# EAGLE schematic aquaUI (EAGLE 6.4)
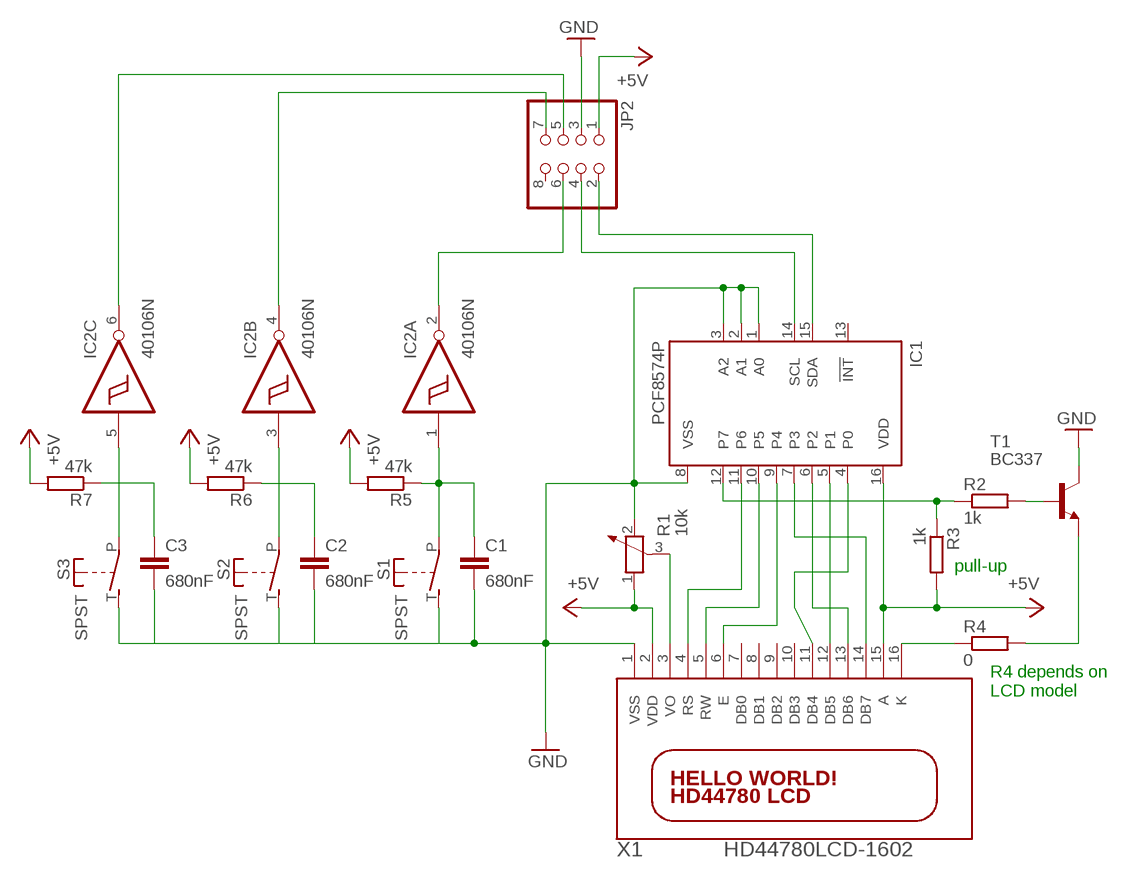
[diagram p0: schematic, sheet 1]

## Parts
C1  680nF  C-EU050-050X075  [C050-050X075]
C2  680nF  C-EU050-050X075  [C050-050X075]
C3  680nF  C-EU050-050X075  [C050-050X075]
IC1  PCF8574P  [DIL16]
IC2  40106N  [DIL14]
JP2  PINHD-2X4  [2X04]
R1  10k  POTENTIOMETER_PT-10  [PT-10]
R2  1k  R-EU_0204/5  [0204/5]
R3  1k  R-EU_0204/5  [0204/5]
R4  0  R-EU_0204/5  [0204/5]
R5  47k  R-EU_0204/5  [0204/5]
R6  47k  R-EU_0204/5  [0204/5]
R7  47k  R-EU_0204/5  [0204/5]
S1  SPST  [JUDCOSPST]
S2  SPST  [JUDCOSPST]
S3  SPST  [JUDCOSPST]
T1  BC337  [TO92]
X1  HD44780LCD-1602  [LCD1602]

## Nets
+5V: IC1.16(VDD) JP2.1 R1.1 R3.2 R5.2 R6.2 R7.2 X1.2(VDD) X1.15(A)
GND: C1.2 C2.2 C3.2 IC1.1(A0) IC1.2(A1) IC1.3(A2) IC1.8(VSS) JP2.3 R1.2 S1.T(S) S2.T(S) S3.T(S) T1.3(C) X1.1(VSS)
N$1: IC1.15(SDA) JP2.2
N$2: IC1.14(SCL) JP2.4
N$3: R1.3 X1.3(VO)
N$4: IC1.4(P0) X1.11(DB4)
N$5: IC1.5(P1) X1.12(DB5)
N$6: IC1.6(P2) X1.13(DB6)
N$7: IC1.7(P3) X1.14(DB7)
N$8: IC1.9(P4) X1.6(E)
N$9: IC1.10(P5) X1.5(RW)
N$10: IC1.11(P6) X1.4(RS)
N$11: IC1.12(P7) R2.1 R3.1
N$12: R2.2 T1.2(B)
N$13: R4.1 X1.16(K)
N$14: R4.2 T1.1(E)
N$15: C1.1 IC2.1(A:I) R5.1 S1.P
N$16: C2.1 IC2.3(B:I) R6.1 S2.P
N$17: C3.1 IC2.5(C:I) R7.1 S3.P
N$18: IC2.2(A:O) JP2.6
N$19: IC2.6(C:O) JP2.5
N$20: IC2.4(B:O) JP2.7
Unconnected: IC1.13(!INT) IC2.8(D:O) IC2.9(D:I) IC2.10(E:O) IC2.11(E:I) IC2.12(F:O) IC2.13(F:I) JP2.8 X1.7(DB0) X1.8(DB1) X1.9(DB2) X1.10(DB3)

## Notes on the sheet
- pull-up
- R4 depends on 
  LCD model

## Power pins joined to a net without a drawn wire
+5V: IC2.14(P:VDD)
GND: IC2.7(P:VSS)

## Library data of the parts
C1-C3 = rcl:C-EU: CAPACITOR, European symbol
IC1 = micro-philips:PCF8574: I2C-Bus Remote 8-bit I/O expander http://www.semiconductors.philips.com/acrobat_download/datasheets/PCF8574_4.pdf; MPN: PCF8574PN; OC_FARNELL: 204020; OC_NEWARK: 11N8515
IC2 = 40xx:40106: Hex SCHMITT TRIGGER
JP2 = adafruit:PINHD-2X4: PIN HEADER
R1 = rcl:POTENTIOMETER_: Potentiometer
R2-R7 = rcl:R-EU_: RESISTOR, European symbol
S1-S3 = adafruit:SPST: Judco 50-0015-00
T1 = transistor:BC337: NPN TRANSISTOR
X1 = adafruit:HD44780LCD: HD44780 LCD Standard character type LCDs, available in sizes from 8x1 to 40x4!